# EAGLE schematic SummerCart64 (EAGLE 9.6.2)
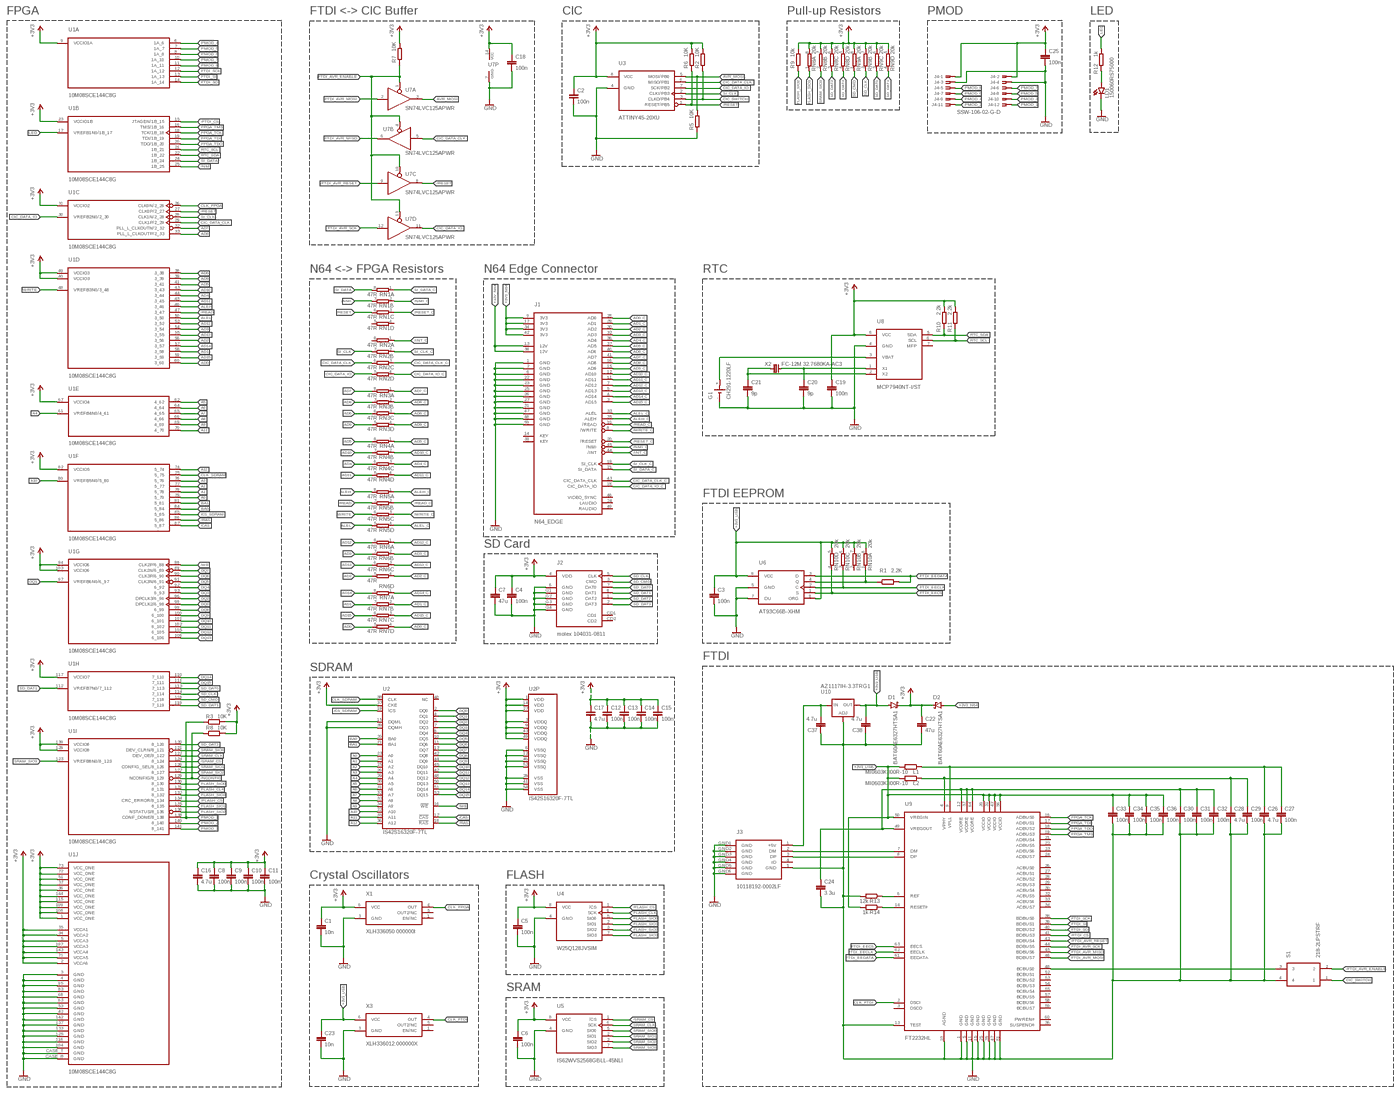
[diagram p0: schematic, sheet 1, overview]
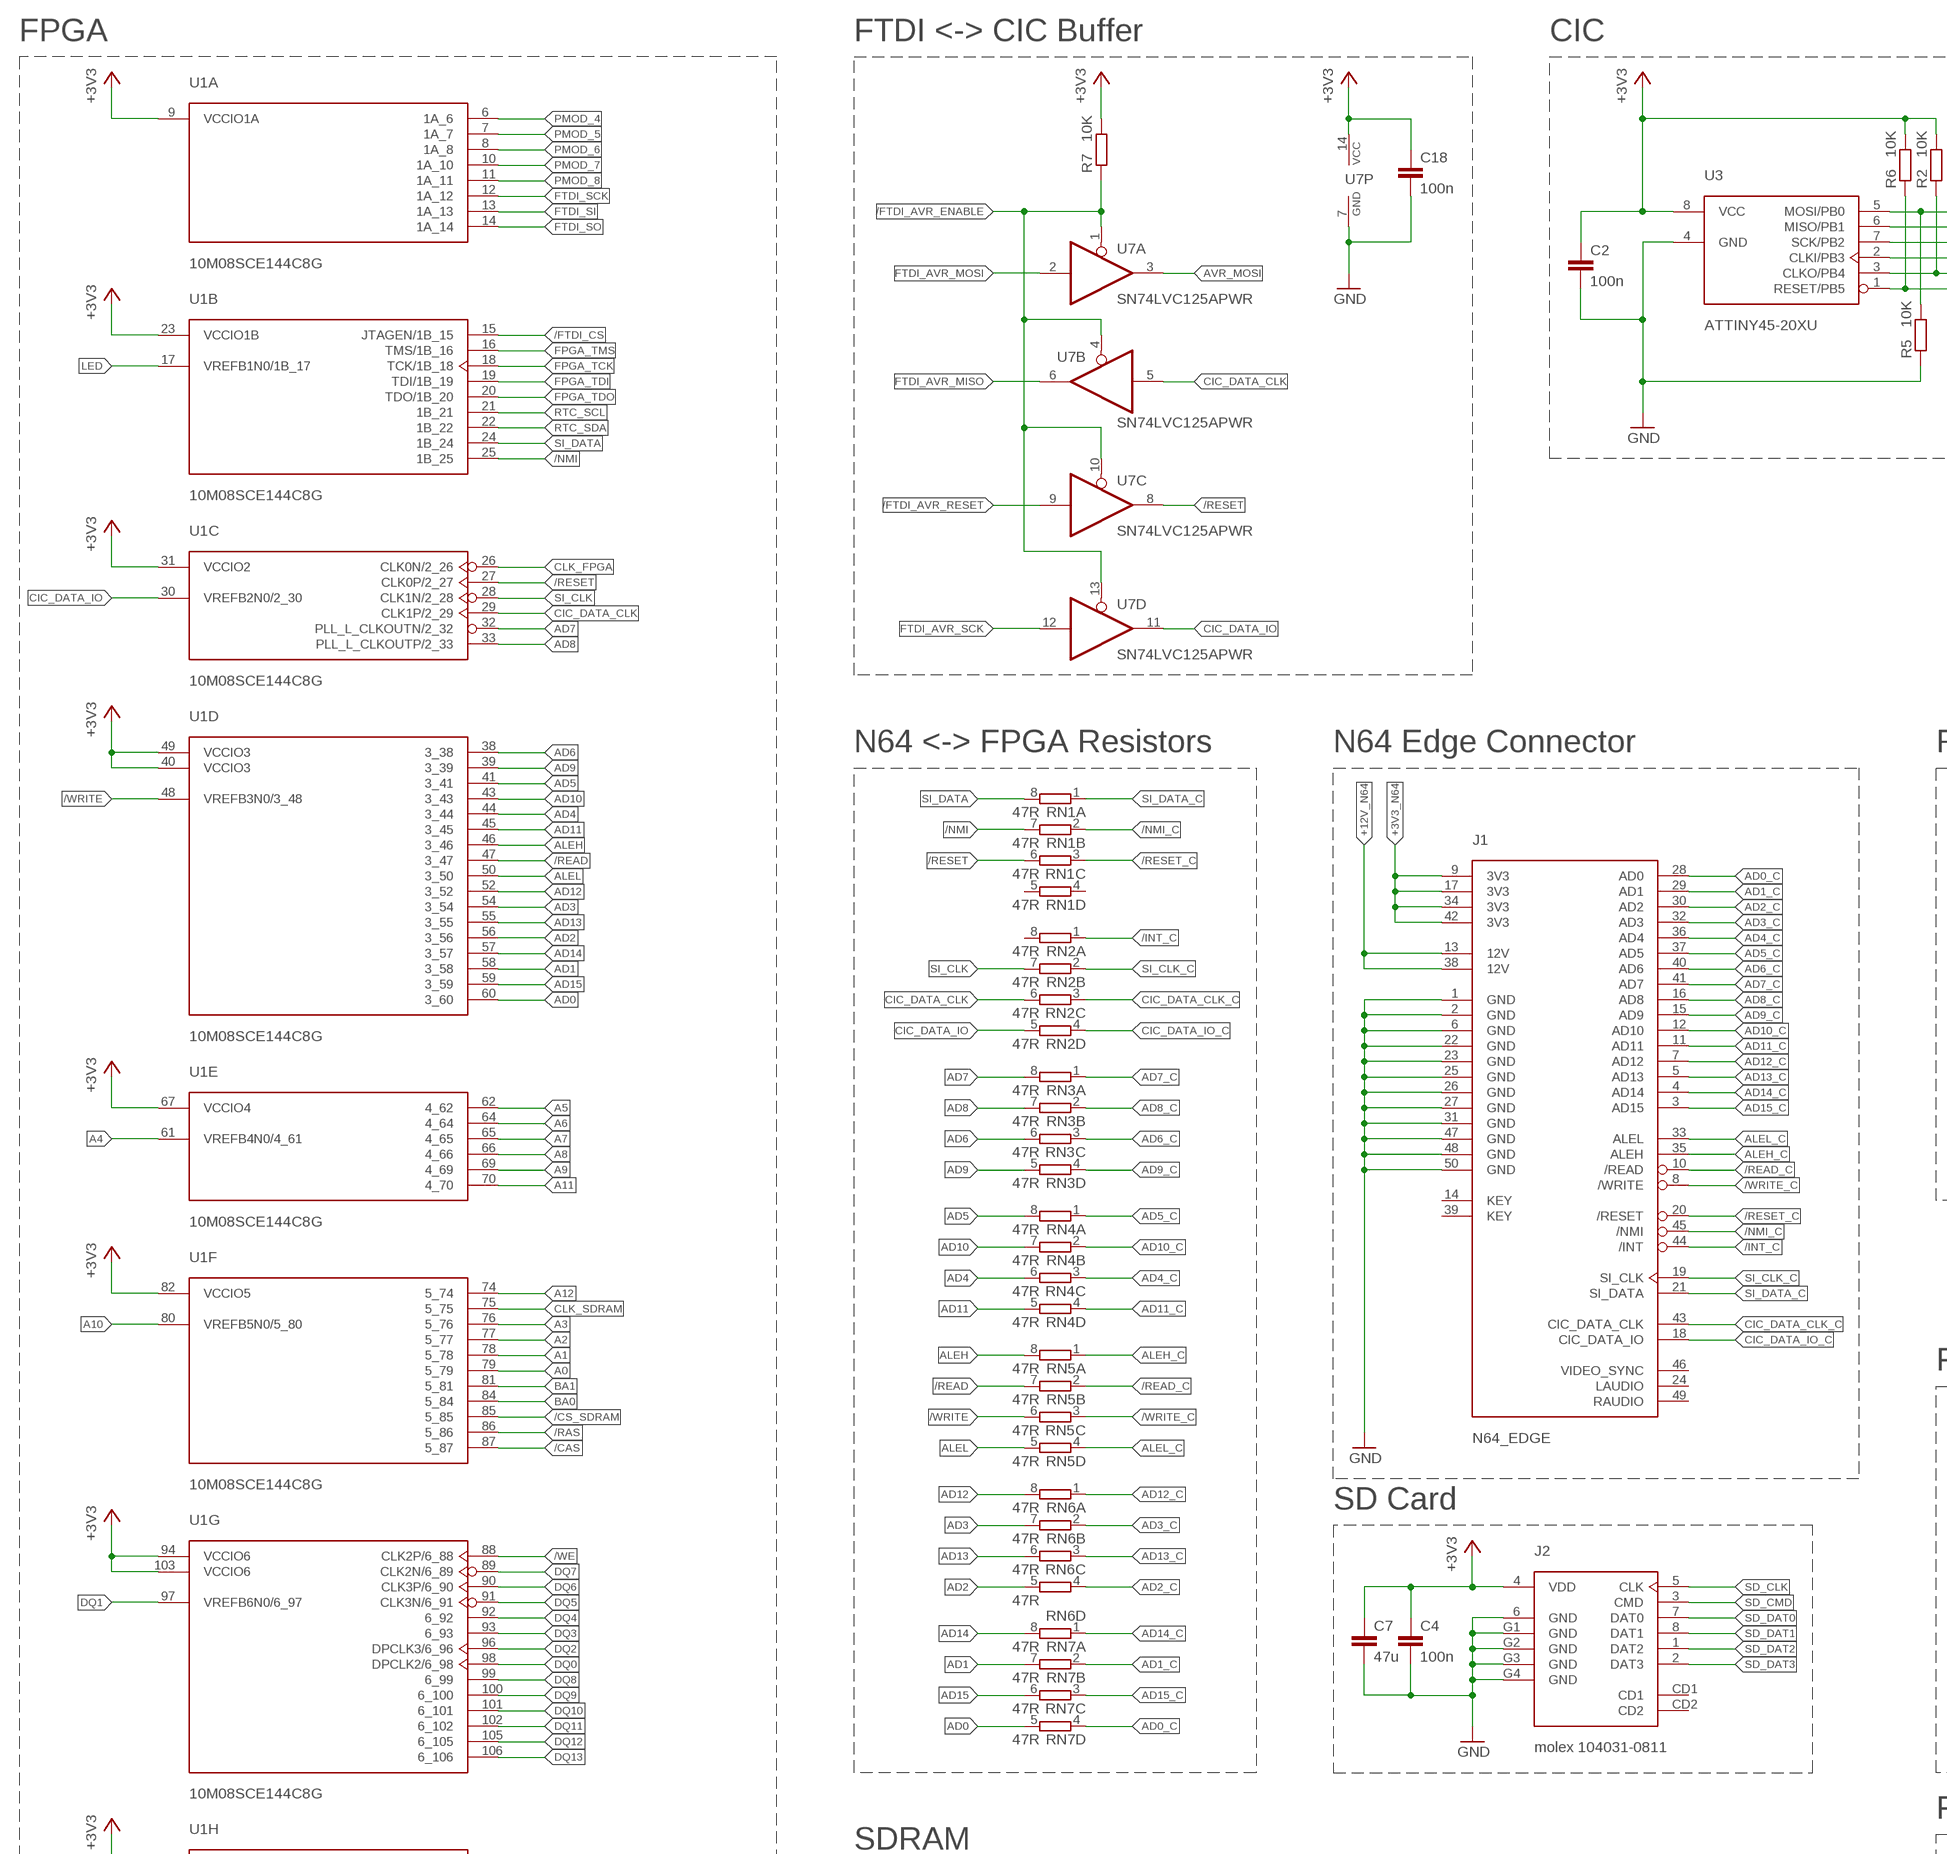
[diagram p1: schematic, sheet 1, part 1 of 4]
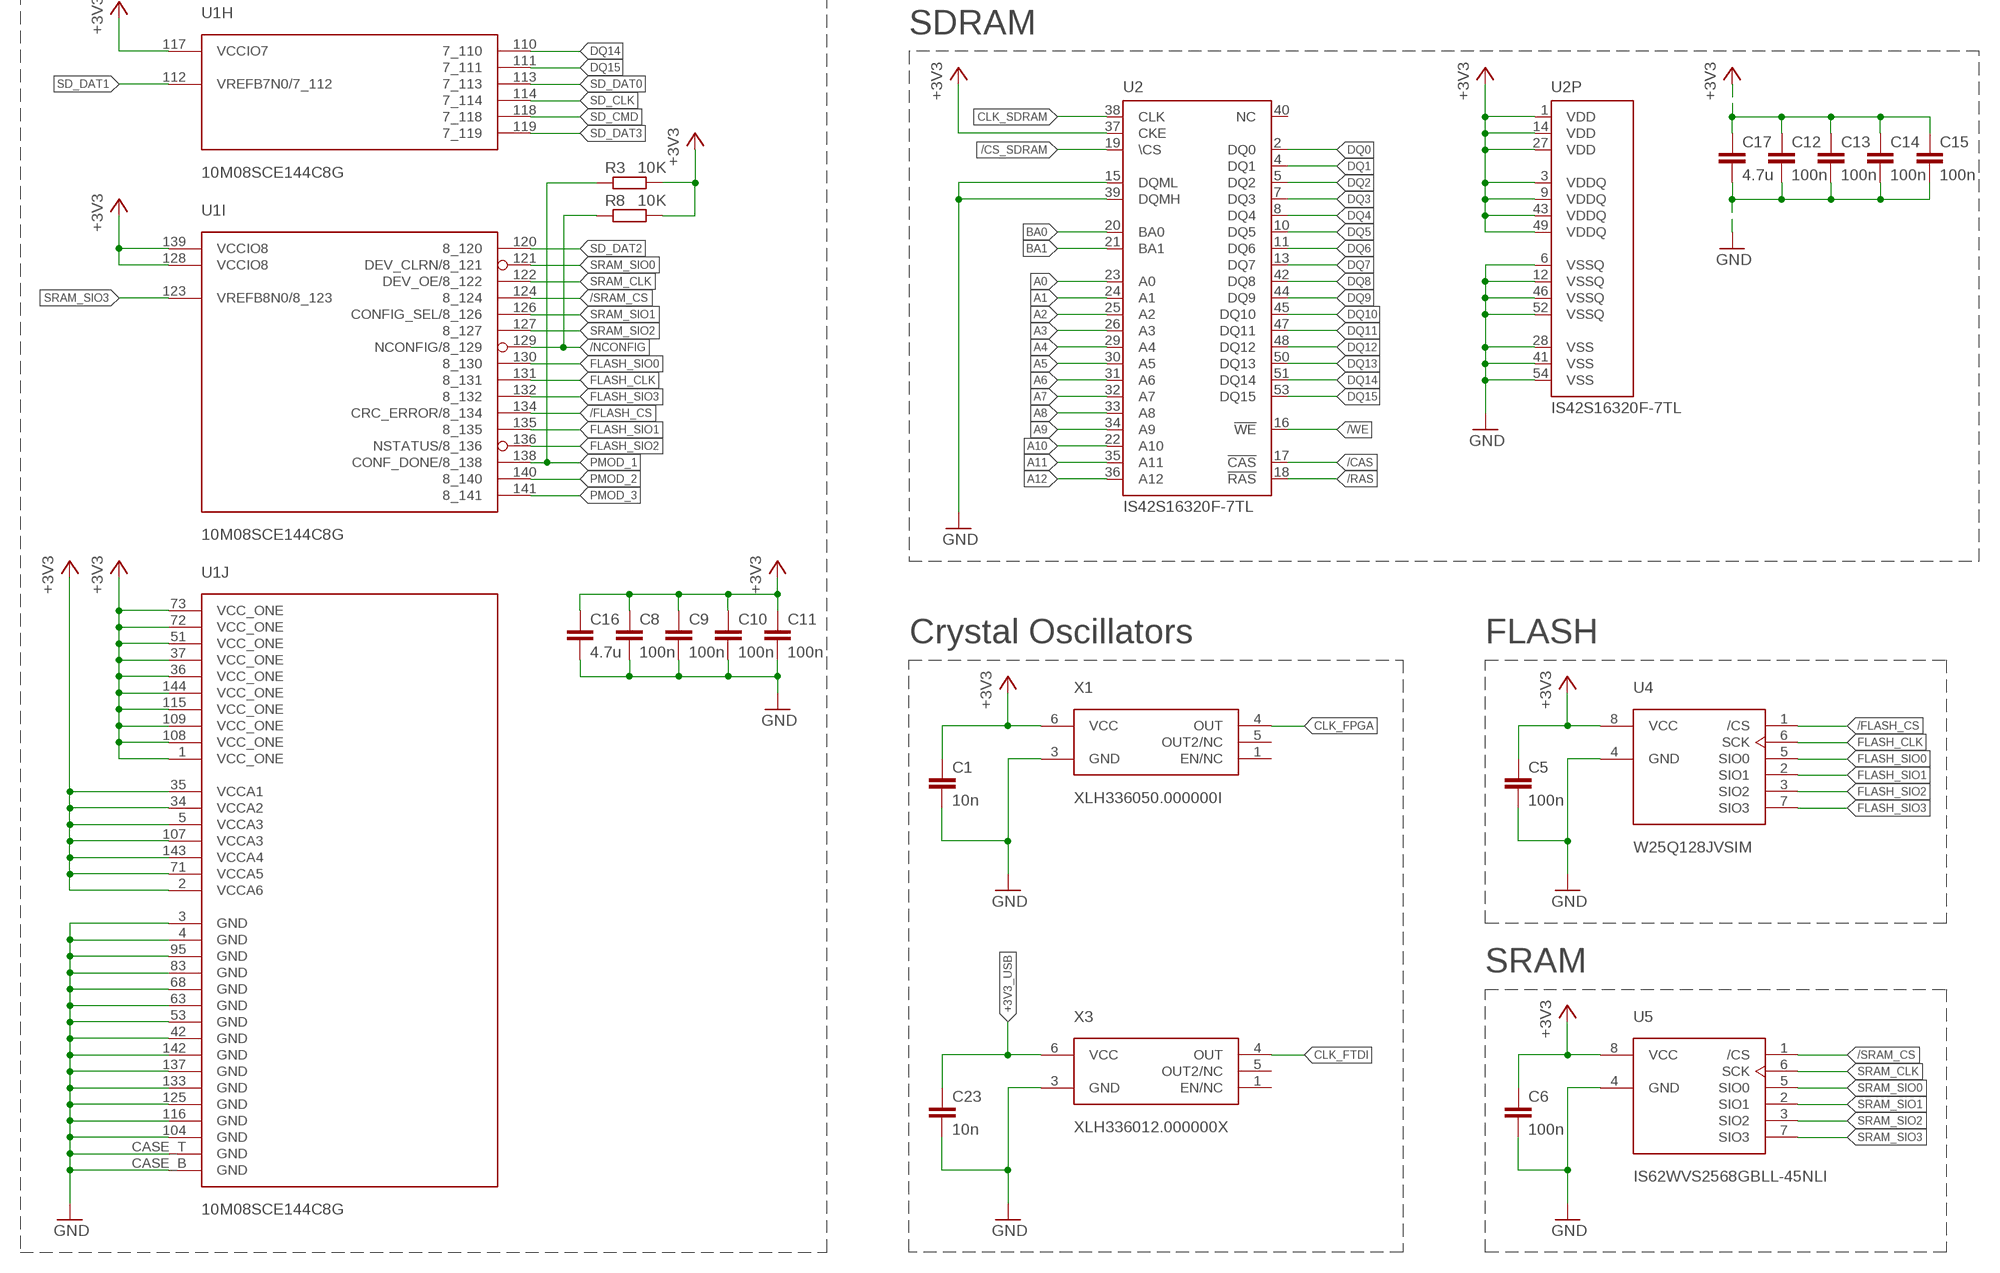
[diagram p2: schematic, sheet 1, part 2 of 4]
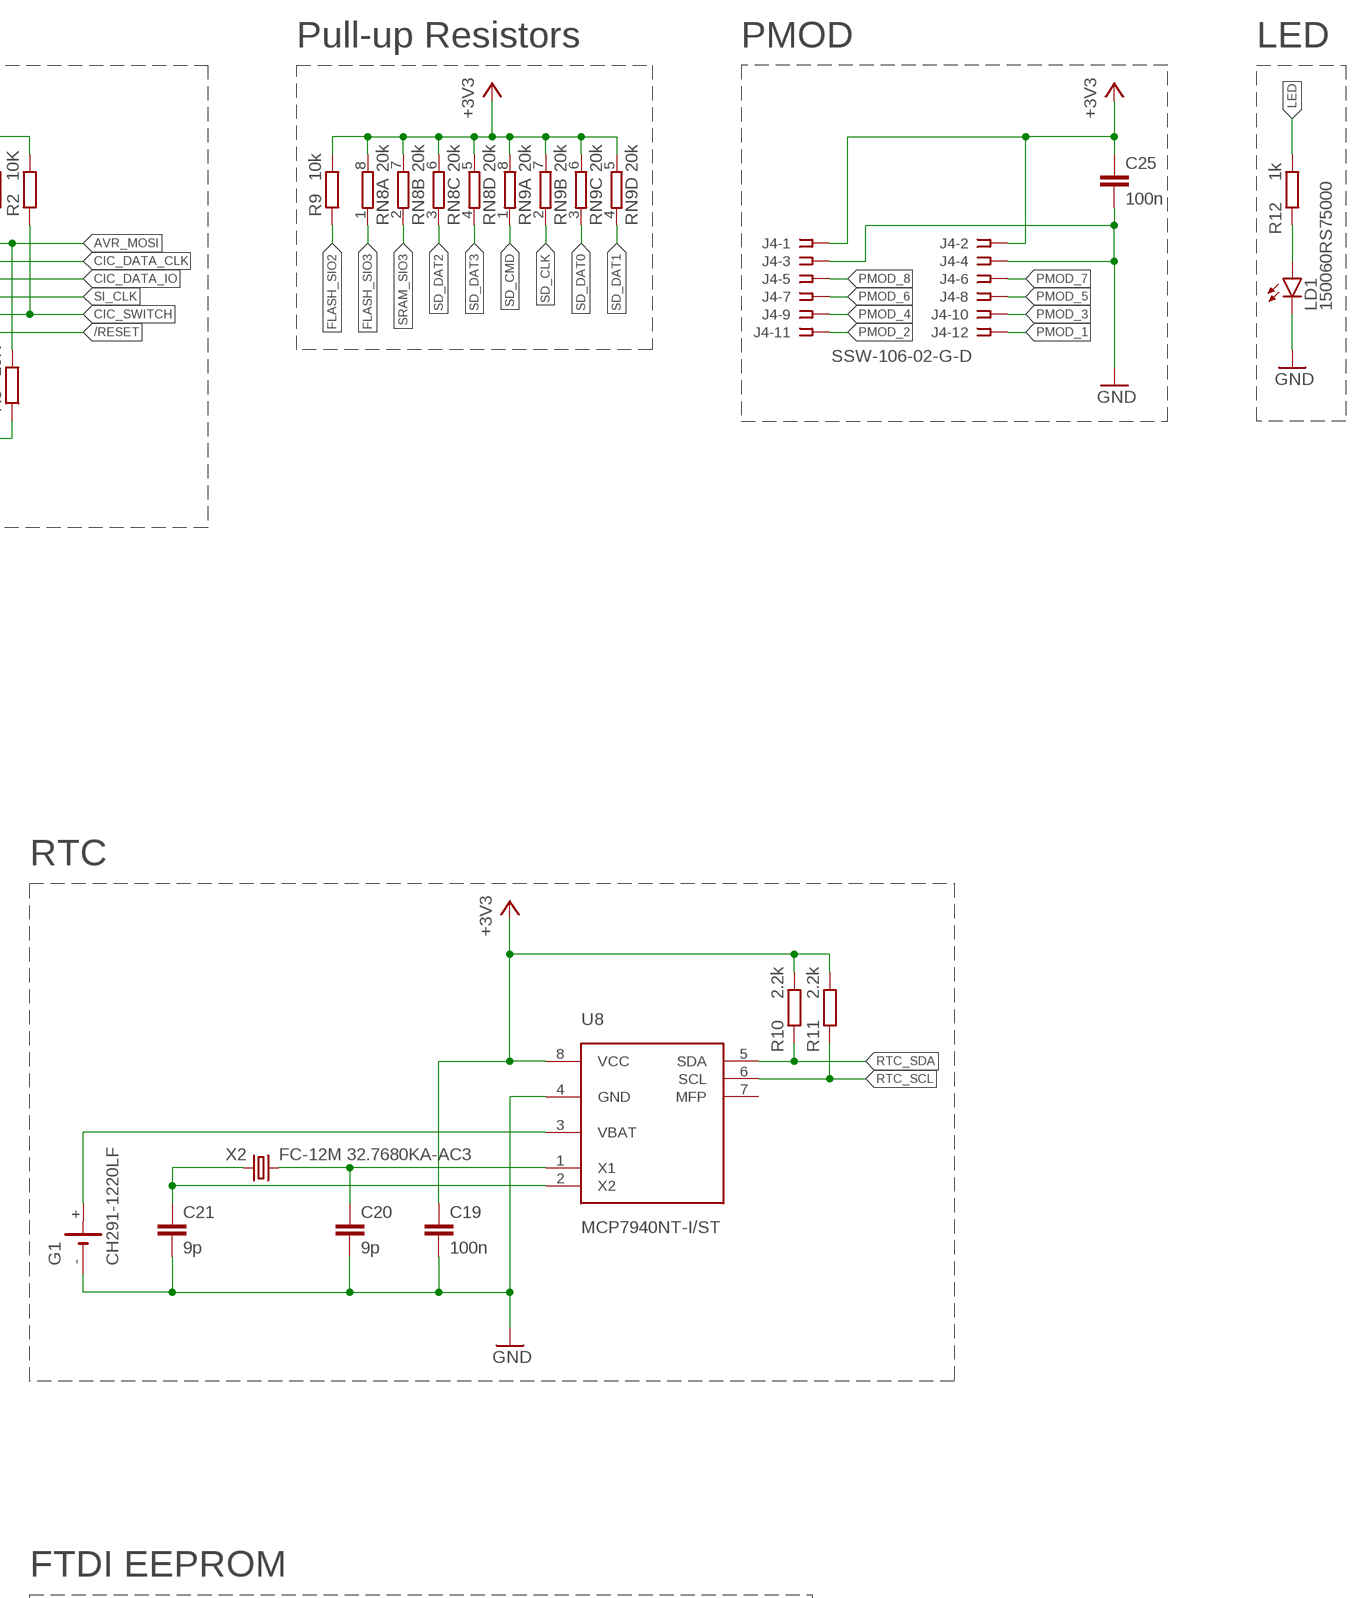
[diagram p3: schematic, sheet 1, part 3 of 4]
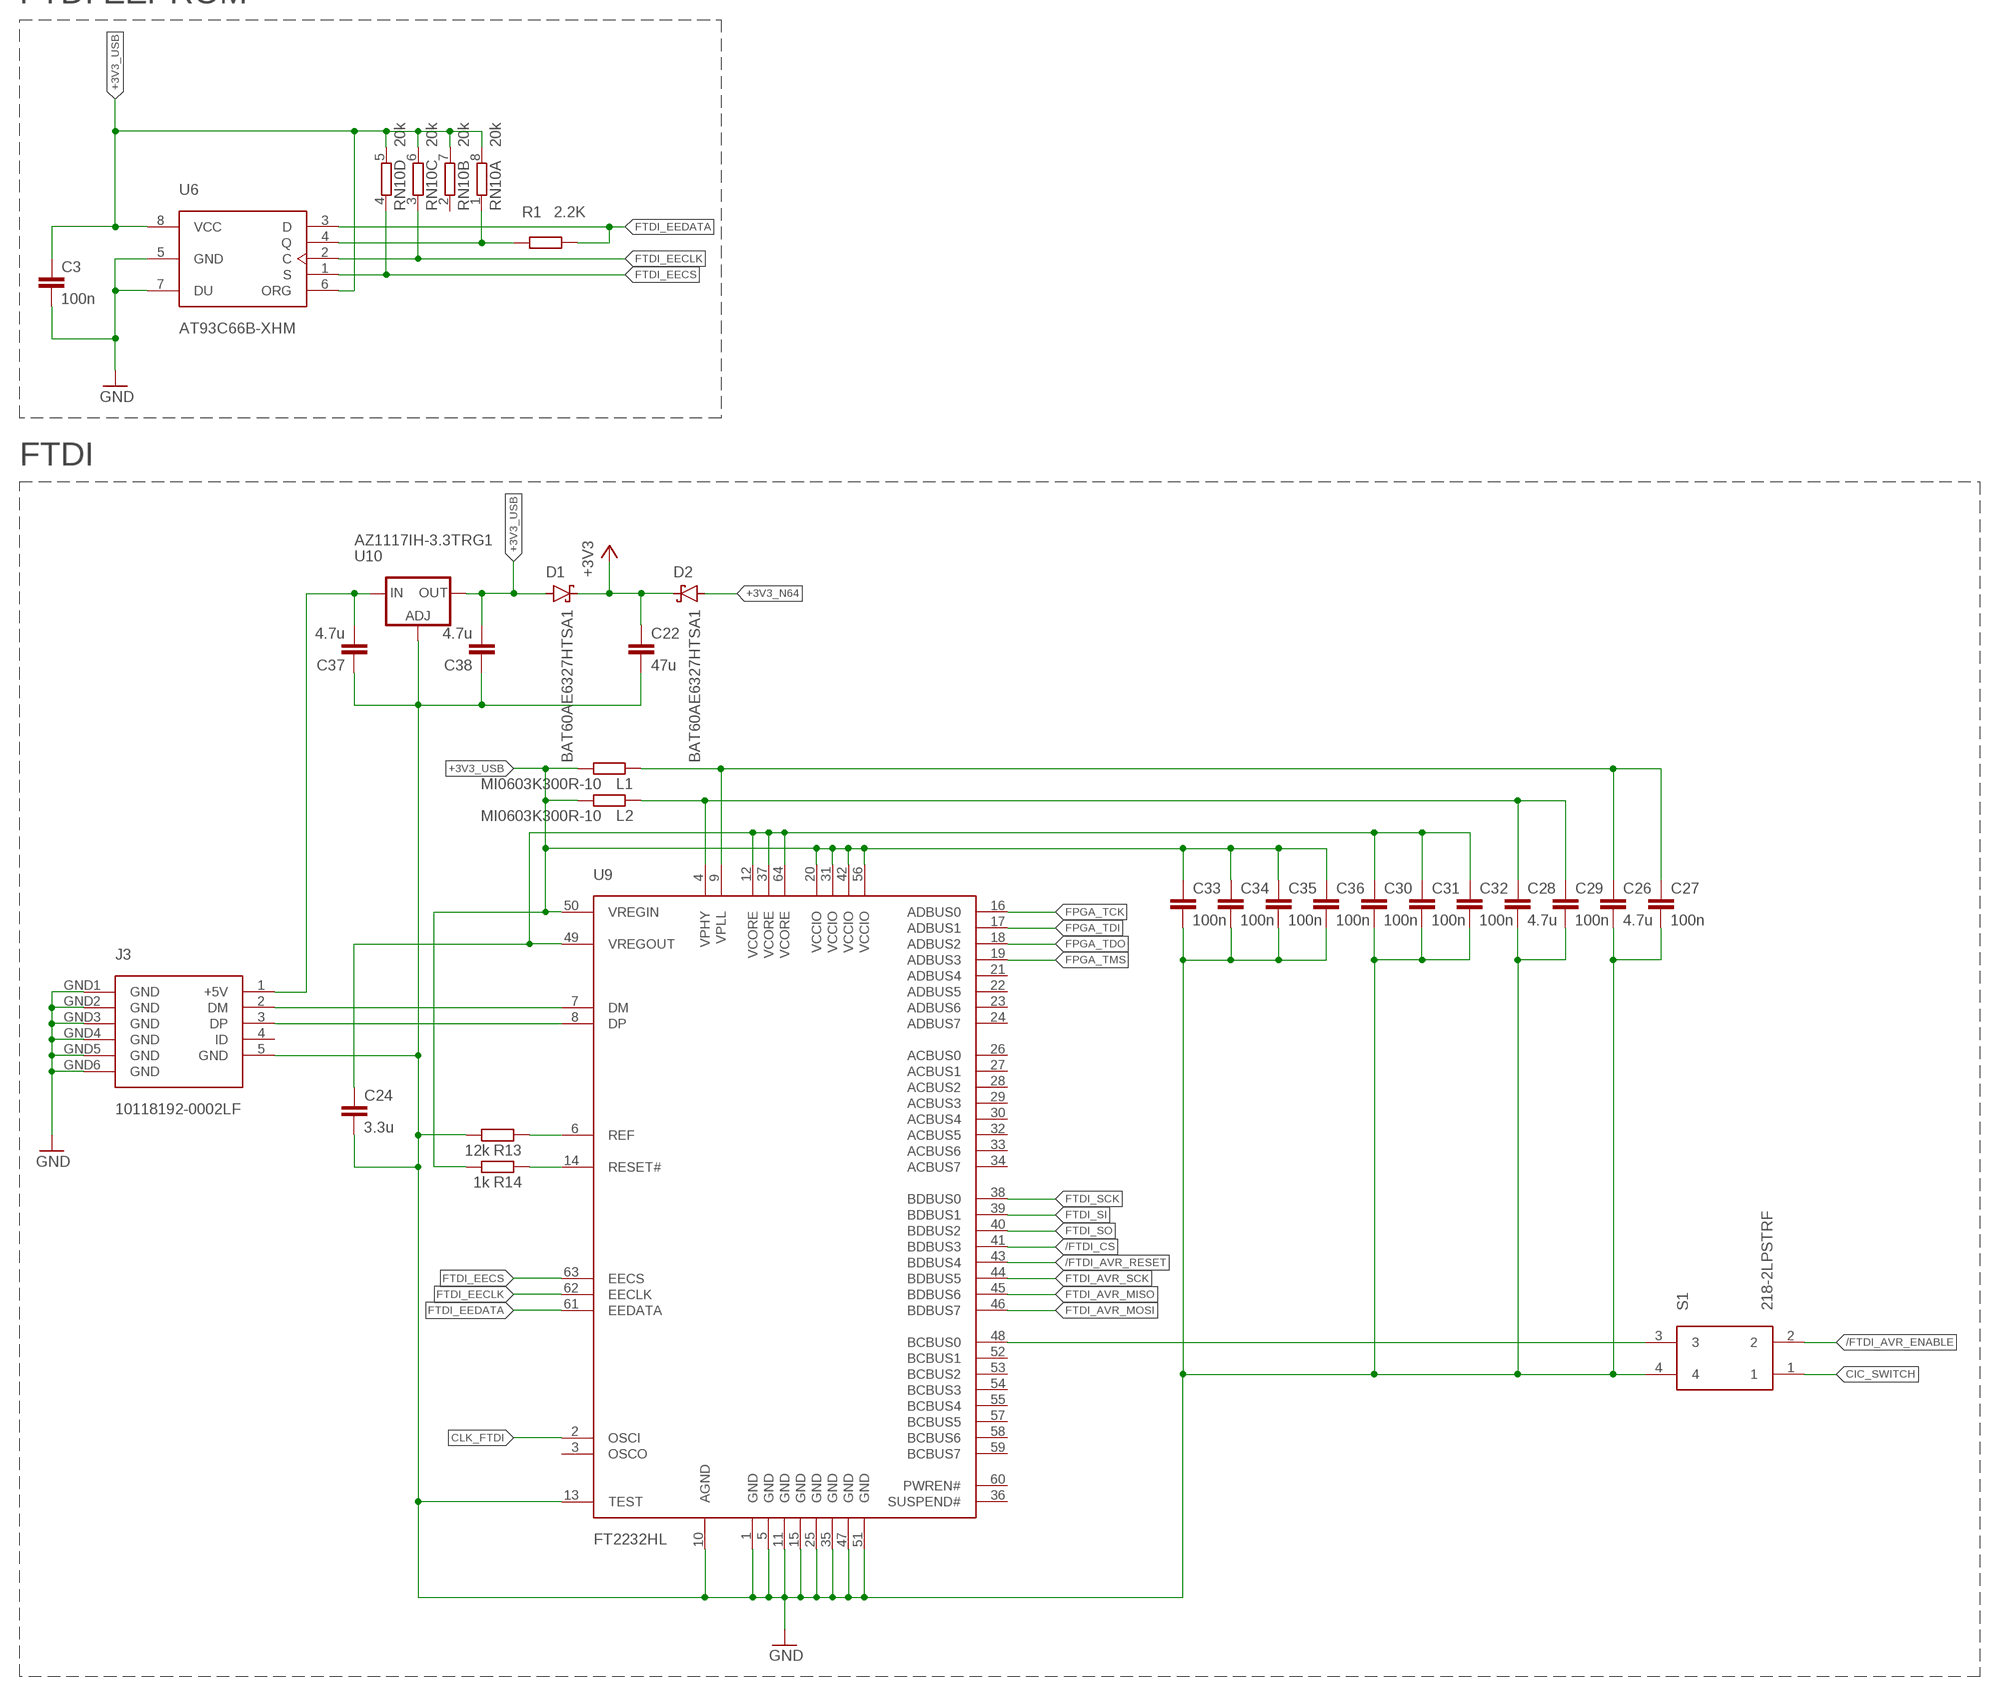
[diagram p4: schematic, sheet 1, part 4 of 4]

## Parts
C1  10n  C-EUC0603  [C0603]
C2  100n  C-EUC0603  [C0603]
C3  100n  C-EUC0603  [C0603]
C4  100n  C-EUC0603  [C0603]
C5  100n  C-EUC0603  [C0603]
C6  100n  C-EUC0603  [C0603]
C7  47u  C-EUC0805  [C0805]
C8  100n  C-EUC0603  [C0603]
C9  100n  C-EUC0603  [C0603]
C10  100n  C-EUC0603  [C0603]
C11  100n  C-EUC0603  [C0603]
C12  100n  C-EUC0603  [C0603]
C13  100n  C-EUC0603  [C0603]
C14  100n  C-EUC0603  [C0603]
C15  100n  C-EUC0603  [C0603]
C16  4.7u  C-EUC0603  [C0603]
C17  4.7u  C-EUC0603  [C0603]
C18  100n  C-EUC0603  [C0603]
C19  100n  C-EUC0603  [C0603]
C20  9p  C-EUC0603  [C0603]
C21  9p  C-EUC0603  [C0603]
C22  47u  C-EUC0805  [C0805]
C23  10n  C-EUC0603  [C0603]
C24  3.3u  C-EUC0603  [C0603]
C25  100n  C-EUC0603  [C0603]
C26  4.7u  C-EUC0603  [C0603]
C27  100n  C-EUC0603  [C0603]
C28  4.7u  C-EUC0603  [C0603]
C29  100n  C-EUC0603  [C0603]
C30  100n  C-EUC0603  [C0603]
C31  100n  C-EUC0603  [C0603]
C32  100n  C-EUC0603  [C0603]
C33  100n  C-EUC0603  [C0603]
C34  100n  C-EUC0603  [C0603]
C35  100n  C-EUC0603  [C0603]
C36  100n  C-EUC0603  [C0603]
C37  4.7u  C-EUC0603  [C0603]
C38  4.7u  C-EUC0603  [C0603]
D1  BAT60AE6327HTSA1  BAT60J  [SOD323_ST]
D2  BAT60AE6327HTSA1  BAT60J  [SOD323_ST]
G1  CH291-1220LF  [CH291-1220LF]
J1  N64_EDGE  [N64_EDGE]
J2  molex 104031-0811  MICRO_SD  [MICRO_SD]
J3  10118192-0002LF  MICRO_USB  [MICRO_USB]
J4  SSW-106-02-G-D  [SSW-106-02-G-D]
L1  MI0603K300R-10  R-EU_R0603  [R0603]
L2  MI0603K300R-10  R-EU_R0603  [R0603]
LD1  150060RS75000  LEDSML0603  [SML0603]
R1  2.2K  R-EU_R0603  [R0603]
R2  10K  R-EU_R0603  [R0603]
R3  10K  R-EU_R0603  [R0603]
R5  10K  R-EU_R0603  [R0603]
R6  10K  R-EU_R0603  [R0603]
R7  10K  R-EU_R0603  [R0603]
R8  10K  R-EU_R0603  [R0603]
R9  10k  R-EU_R0603  [R0603]
R10  2.2k  R-EU_R0603  [R0603]
R11  2.2k  R-EU_R0603  [R0603]
R12  1k  R-EU_R0603  [R0603]
R13  12k  R-EU_R0603  [R0603]
R14  1k  R-EU_R0603  [R0603]
RN1  47R  4R-NCAY16  [CAY16]
RN2  47R  4R-NCAY16  [CAY16]
RN3  47R  4R-NCAY16  [CAY16]
RN4  47R  4R-NCAY16  [CAY16]
RN5  47R  4R-NCAY16  [CAY16]
RN6  47R  4R-NCAY16  [CAY16]
RN7  47R  4R-NCAY16  [CAY16]
RN8  20k  4R-NCAY16  [CAY16]
RN9  20k  4R-NCAY16  [CAY16]
RN10  20k  4R-NCAY16  [CAY16]
S1  218-2LPSTRF  218-2  [218-2]
U1  10M08SCE144C8G  [EQFP144]
U2  IS42S16320F-7TL  MT48LC16M16A2  [TSOP54-400]
U3  ATTINY45-20XU  ATTINY45  [TSSOP8]
U4  W25Q128JVSIM  [SO8_208MIL]
U5  IS62WVS2568GBLL-45NLI  [SO8_150MIL]
U6  AT93C66B-XHM  93C66  [TSSOP8]
U7  SN74LVC125APWR  74ABT125PW  [TSSOP14]
U8  MCP7940NT-I/ST  MCP7940N  [TSSOP8]
U9  FT2232HL  [LQFP64]
U10  AZ1117IH-3.3TRG1  LD117AS33TR  [SOT223]
X1  XLH336050.000000I  XLH336  [3.2X2.5_OSCILLATOR]
X2  FC-12M 32.7680KA-AC3  FC-12M  [FC-12M]
X3  XLH336012.000000X  XLH336  [3.2X2.5_OSCILLATOR]

## Nets
+1.8V_USB: C24.1 C30.1 C31.1 C32.1 U9.12(VCORE) U9.37(VCORE) U9.49(VREGOUT) U9.64(VCORE)
+3V3: C1.1 C2.1 C4.1 C5.1 C6.1 C7.1 C8.1 C9.1 C10.1 C11.1 C12.1 C13.1 C14.1 C15.1 C16.1 C17.1 C18.1 C19.1 C22.1 C25.1 D1.C D2.C J2.4(VDD) J4.1 J4.2 R2.2 R3.2 R6.2 R7.2 R8.2 R9.2 R10.2 R11.2 RN8.5 RN8.6 RN8.7 RN8.8 RN9.5 RN9.6 RN9.7 RN9.8 U1.1(J:VCC_ONE) U1.2(J:VCCA6) U1.5(J:VCCA3) U1.9(A:VCCIO1A) U1.23(B:VCCIO1B) U1.31(C:VCCIO2) U1.34(J:VCCA2) U1.35(J:VCCA1) U1.36(J:VCC_ONE) U1.37(J:VCC_ONE) U1.40(D:VCCIO3) U1.49(D:VCCIO3) U1.51(J:VCC_ONE) U1.67(E:VCCIO4) U1.71(J:VCCA5) U1.72(J:VCC_ONE) U1.73(J:VCC_ONE) U1.82(F:VCCIO5) U1.94(G:VCCIO6) U1.103(G:VCCIO6) U1.107(J:VCCA3) U1.108(J:VCC_ONE) U1.109(J:VCC_ONE) U1.115(J:VCC_ONE) U1.117(H:VCCIO7) U1.128(I:VCCIO8) U1.139(I:VCCIO8) U1.143(J:VCCA4) U1.144(J:VCC_ONE) U2.1(VDD) U2.3(VDDQ) U2.9(VDDQ) U2.14(VDD) U2.27(VDD) U2.37(CKE) U2.43(VDDQ) U2.49(VDDQ) U3.8(VCC) U4.8(VCC) U5.8(VCC) U7.14(P:VCC) U8.8(VCC) X1.6(VCC)
+3V3_N64: D2.A J1.9(3V3) J1.17(3V3) J1.34(3V3) J1.42(3V3)
+3V3_USB: C3.1 C23.1 C33.1 C34.1 C35.1 C36.1 C38.2 D1.A L1.2 L2.2 R14.2 RN10.5 RN10.6 RN10.7 RN10.8 U6.6(ORG) U6.8(VCC) U9.20(VCCIO) U9.31(VCCIO) U9.42(VCCIO) U9.50(VREGIN) U9.56(VCCIO) U10.4(OUT) X3.6(VCC)
+5V_USB: C37.2 J3.1(+5V) U10.3(IN)
+12V_N64: J1.13(12V) J1.38(12V)
/CAS: U1.87(F:5_87) U2.17(!CAS)
/CS_SDRAM: U1.85(F:5_85) U2.19(\CS)
/FLASH_CS: U1.134(I:CRC_ERROR/8_134) U4.1(/CS)
/FTDI_AVR_ENABLE: R7.1 S1.2 U7.1(A:OE) U7.4(B:OE) U7.10(C:OE) U7.13(D:OE)
/FTDI_AVR_RESET: U7.9(C:I) U9.43(BDBUS4)
/FTDI_CS: U1.15(B:JTAGEN/1B_15) U9.41(BDBUS3)
/INT_C: J1.44(/INT) RN2.1
/NCONFIG: R8.1 U1.129(I:NCONFIG/8_129)
/NMI: RN1.7 U1.25(B:1B_25)
/NMI_C: J1.45(/NMI) RN1.2
/RAS: U1.86(F:5_86) U2.18(!RAS)
/READ: RN5.7 U1.47(D:3_47)
/READ_C: J1.10(/READ) RN5.2
/RESET: R6.1 RN1.6 U1.27(C:CLK0P/2_27) U3.1(RESET/PB5) U7.8(C:O)
/RESET_C: J1.20(/RESET) RN1.3
/SRAM_CS: U1.124(I:8_124) U5.1(/CS)
/WE: U1.88(G:CLK2P/6_88) U2.16(!WE)
/WRITE: RN5.6 U1.48(D:VREFB3N0/3_48)
/WRITE_C: J1.8(/WRITE) RN5.3
A0: U1.79(F:5_79) U2.23(A0)
A1: U1.78(F:5_78) U2.24(A1)
A2: U1.77(F:5_77) U2.25(A2)
A3: U1.76(F:5_76) U2.26(A3)
A4: U1.61(E:VREFB4N0/4_61) U2.29(A4)
A5: U1.62(E:4_62) U2.30(A5)
A6: U1.64(E:4_64) U2.31(A6)
A7: U1.65(E:4_65) U2.32(A7)
A8: U1.66(E:4_66) U2.33(A8)
A9: U1.69(E:4_69) U2.34(A9)
A10: U1.80(F:VREFB5N0/5_80) U2.22(A10)
A11: U1.70(E:4_70) U2.35(A11)
A12: U1.74(F:5_74) U2.36(A12)
AD0: RN7.5 U1.60(D:3_60)
AD0_C: J1.28(AD0) RN7.4
AD1: RN7.7 U1.58(D:3_58)
AD1_C: J1.29(AD1) RN7.2
AD2: RN6.5 U1.56(D:3_56)
AD2_C: J1.30(AD2) RN6.4
AD3: RN6.7 U1.54(D:3_54)
AD3_C: J1.32(AD3) RN6.2
AD4: RN4.6 U1.44(D:3_44)
AD4_C: J1.36(AD4) RN4.3
AD5: RN4.8 U1.41(D:3_41)
AD5_C: J1.37(AD5) RN4.1
AD6: RN3.6 U1.38(D:3_38)
AD6_C: J1.40(AD6) RN3.3
AD7: RN3.8 U1.32(C:PLL_L_CLKOUTN/2_32)
AD7_C: J1.41(AD7) RN3.1
AD8: RN3.7 U1.33(C:PLL_L_CLKOUTP/2_33)
AD8_C: J1.16(AD8) RN3.2
AD9: RN3.5 U1.39(D:3_39)
AD9_C: J1.15(AD9) RN3.4
AD10: RN4.7 U1.43(D:3_43)
AD10_C: J1.12(AD10) RN4.2
AD11: RN4.5 U1.45(D:3_45)
AD11_C: J1.11(AD11) RN4.4
AD12: RN6.8 U1.52(D:3_52)
AD12_C: J1.7(AD12) RN6.1
AD13: RN6.6 U1.55(D:3_55)
AD13_C: J1.5(AD13) RN6.3
AD14: RN7.8 U1.57(D:3_57)
AD14_C: J1.4(AD14) RN7.1
AD15: RN7.6 U1.59(D:3_59)
AD15_C: J1.3(AD15) RN7.3
ALEH: RN5.8 U1.46(D:3_46)
ALEH_C: J1.35(ALEH) RN5.1
ALEL: RN5.5 U1.50(D:3_50)
ALEL_C: J1.33(ALEL) RN5.4
AVR_MOSI: R5.2 U3.5(MOSI/PB0) U7.3(A:O)
BA0: U1.84(F:5_84) U2.20(BA0)
BA1: U1.81(F:5_81) U2.21(BA1)
CIC_DATA_CLK: RN2.6 U1.29(C:CLK1P/2_29) U3.6(MISO/PB1) U7.5(B:I)
CIC_DATA_CLK_C: J1.43(CIC_DATA_CLK) RN2.3
CIC_DATA_IO: RN2.5 U1.30(C:VREFB2N0/2_30) U3.7(SCK/PB2) U7.11(D:O)
CIC_DATA_IO_C: J1.18(CIC_DATA_IO) RN2.4
CIC_SWITCH: R2.1 S1.1 U3.3(CLKO/PB4)
CLK_FPGA: U1.26(C:CLK0N/2_26) X1.4(OUT)
CLK_FTDI: U9.2(OSCI) X3.4(OUT)
CLK_SDRAM: U1.75(F:5_75) U2.38(CLK)
D_N: J3.2(DM) U9.7(DM)
D_P: J3.3(DP) U9.8(DP)
DQ0: U1.98(G:DPCLK2/6_98) U2.2(DQ0)
DQ1: U1.97(G:VREFB6N0/6_97) U2.4(DQ1)
DQ2: U1.96(G:DPCLK3/6_96) U2.5(DQ2)
DQ3: U1.93(G:6_93) U2.7(DQ3)
DQ4: U1.92(G:6_92) U2.8(DQ4)
DQ5: U1.91(G:CLK3N/6_91) U2.10(DQ5)
DQ6: U1.90(G:CLK3P/6_90) U2.11(DQ6)
DQ7: U1.89(G:CLK2N/6_89) U2.13(DQ7)
DQ8: U1.99(G:6_99) U2.42(DQ8)
DQ9: U1.100(G:6_100) U2.44(DQ9)
DQ10: U1.101(G:6_101) U2.45(DQ10)
DQ11: U1.102(G:6_102) U2.47(DQ11)
DQ12: U1.105(G:6_105) U2.48(DQ12)
DQ13: U1.106(G:6_106) U2.50(DQ13)
DQ14: U1.110(H:7_110) U2.51(DQ14)
DQ15: U1.111(H:7_111) U2.53(DQ15)
FLASH_CLK: U1.131(I:8_131) U4.6(SCK)
FLASH_SIO0: U1.130(I:8_130) U4.5(SIO0)
FLASH_SIO1: U1.135(I:8_135) U4.2(SIO1)
FLASH_SIO2: R9.1 U1.136(I:NSTATUS/8_136) U4.3(SIO2)
FLASH_SIO3: RN8.1 U1.132(I:8_132) U4.7(SIO3)
FPGA_TCK: U1.18(B:TCK/1B_18) U9.16(ADBUS0)
FPGA_TDI: U1.19(B:TDI/1B_19) U9.17(ADBUS1)
FPGA_TDO: U1.20(B:TDO/1B_20) U9.18(ADBUS2)
FPGA_TMS: U1.16(B:TMS/1B_16) U9.19(ADBUS3)
FTDI_AVR_MISO: U7.6(B:O) U9.45(BDBUS6)
FTDI_AVR_MOSI: U7.2(A:I) U9.46(BDBUS7)
FTDI_AVR_SCK: U7.12(D:I) U9.44(BDBUS5)
FTDI_EECLK: RN10.3 U6.2(C) U9.62(EECLK)
FTDI_EECS: RN10.4 U6.1(S) U9.63(EECS)
FTDI_EEDATA: R1.2 U6.3(D) U9.61(EEDATA)
FTDI_REF: R13.1 U9.6(REF)
FTDI_RESET: R14.1 U9.14(RESET#)
FTDI_SCK: U1.12(A:1A_12) U9.38(BDBUS0)
FTDI_SI: U1.13(A:1A_13) U9.39(BDBUS1)
FTDI_SO: U1.14(A:1A_14) U9.40(BDBUS2)
FTDI_VPHY: C28.1 C29.1 L2.1 U9.4(VPHY)
FTDI_VPLL: C26.1 C27.1 L1.1 U9.9(VPLL)
GND: C1.2 C2.2 C3.2 C4.2 C5.2 C6.2 C7.2 C8.2 C9.2 C10.2 C11.2 C12.2 C13.2 C14.2 C15.2 C16.2 C17.2 C18.2 C19.2 C20.2 C21.2 C22.2 C23.2 C24.2 C25.2 C26.2 C27.2 C28.2 C29.2 C30.2 C31.2 C32.2 C33.2 C34.2 C35.2 C36.2 C37.1 C38.1 G1.- J1.1(GND) J1.2(GND) J1.6(GND) J1.22(GND) J1.23(GND) J1.25(GND) J1.26(GND) J1.27(GND) J1.31(GND) J1.47(GND) J1.48(GND) J1.50(GND) J2.6(GND) J2.G1(GND) J2.G2(GND) J2.G3(GND) J2.G4(GND) J3.5(GND) J3.GND1(GND) J3.GND2(GND) J3.GND3(GND) J3.GND4(GND) J3.GND5(GND) J3.GND6(GND) J4.3 J4.4 LD1.C R5.1 R13.2 S1.4 U1.3(J:GND) U1.4(J:GND) U1.42(J:GND) U1.53(J:GND) U1.63(J:GND) U1.68(J:GND) U1.83(J:GND) U1.95(J:GND) U1.104(J:GND) U1.116(J:GND) U1.125(J:GND) U1.133(J:GND) U1.137(J:GND) U1.142(J:GND) U1.CASE_B(J:GND) U1.CASE_T(J:GND) U2.6(VSSQ) U2.12(VSSQ) U2.15(DQML) U2.28(VSS) U2.39(DQMH) U2.41(VSS) U2.46(VSSQ) U2.52(VSSQ) U2.54(VSS) U3.4(GND) U4.4(GND) U5.4(GND) U6.5(GND) U6.7(DU) U7.7(P:GND) U8.4(GND) U9.1(GND) U9.5(GND) U9.10(AGND) U9.11(GND) U9.13(TEST) U9.15(GND) U9.25(GND) U9.35(GND) U9.47(GND) U9.51(GND) U10.1(ADJ) X1.3(GND) X3.3(GND)
LED: R12.2 U1.17(B:VREFB1N0/1B_17)
N$2: S1.3 U9.48(BCBUS0)
N$4: LD1.A R12.1
N$16: R1.1 RN10.1 U6.4(Q)
PMOD_1: J4.12 R3.1 U1.138(I:CONF_DONE/8_138)
PMOD_2: J4.11 U1.140(I:8_140)
PMOD_3: J4.10 U1.141(I:8_141)
PMOD_4: J4.9 U1.6(A:1A_6)
PMOD_5: J4.8 U1.7(A:1A_7)
PMOD_6: J4.7 U1.8(A:1A_8)
PMOD_7: J4.6 U1.10(A:1A_10)
PMOD_8: J4.5 U1.11(A:1A_11)
RTC_SCL: R11.1 U1.21(B:1B_21) U8.6(SCL)
RTC_SDA: R10.1 U1.22(B:1B_22) U8.5(SDA)
RTC_VBAT: G1.+ U8.3(VBAT)
RTC_X1: C20.1 U8.1(X1) X2.2
RTC_X2: C21.1 U8.2(X2) X2.1
SD_CLK: J2.5(CLK) RN9.2 U1.114(H:7_114)
SD_CMD: J2.3(CMD) RN9.1 U1.118(H:7_118)
SD_DAT0: J2.7(DAT0) RN9.3 U1.113(H:7_113)
SD_DAT1: J2.8(DAT1) RN9.4 U1.112(H:VREFB7N0/7_112)
SD_DAT2: J2.1(DAT2) RN8.3 U1.120(I:8_120)
SD_DAT3: J2.2(DAT3) RN8.4 U1.119(H:7_119)
SI_CLK: RN2.7 U1.28(C:CLK1N/2_28) U3.2(CLKI/PB3)
SI_CLK_C: J1.19(SI_CLK) RN2.2
SI_DATA: RN1.8 U1.24(B:1B_24)
SI_DATA_C: J1.21(SI_DATA) RN1.1
SRAM_CLK: U1.122(I:DEV_OE/8_122) U5.6(SCK)
SRAM_SIO0: U1.121(I:DEV_CLRN/8_121) U5.5(SIO0)
SRAM_SIO1: U1.126(I:CONFIG_SEL/8_126) U5.2(SIO1)
SRAM_SIO2: U1.127(I:8_127) U5.3(SIO2)
SRAM_SIO3: RN8.2 U1.123(I:VREFB8N0/8_123) U5.7(SIO3)
Unconnected: J1.14(KEY) J1.24(LAUDIO) J1.39(KEY) J1.46(VIDEO_SYNC) J1.49(RAUDIO) J2.CD1 J2.CD2 J3.4(ID) RN1.4 RN1.5 RN2.8 RN10.2 U2.40(NC) U8.7(MFP) U9.3(OSCO) U9.21(ADBUS4) U9.22(ADBUS5) U9.23(ADBUS6) U9.24(ADBUS7) U9.26(ACBUS0) U9.27(ACBUS1) U9.28(ACBUS2) U9.29(ACBUS3) U9.30(ACBUS4) U9.32(ACBUS5) U9.33(ACBUS6) U9.34(ACBUS7) U9.36(SUSPEND#) U9.52(BCBUS1) U9.53(BCBUS2) U9.54(BCBUS3) U9.55(BCBUS4) U9.57(BCBUS5) U9.58(BCBUS6) U9.59(BCBUS7) U9.60(PWREN#) X1.1(EN/NC) X1.5(OUT2/NC) X3.1(EN/NC) X3.5(OUT2/NC)

## Notes on the sheet
- FPGA | FTDI <-> CIC Buffer | CIC | Pull-up Resistors | PMOD | LED
- N64 <-> FPGA Resistors | N64 Edge Connector | RTC
- FTDI EEPROM
- SD Card
- FTDI
- SDRAM
- Crystal Oscillators | FLASH
- SRAM

## Library data of the parts
C1-C38 = rcl:C-EU: CAPACITOR, European symbol; SPICEPREFIX: C
D1 D2 = diode:BAT60J: Schottky barrier diode Source: www.st.com, BAT60J.pdf
G1 = battery:CH291-1220LF: Battery Holder, SMT, 12mm multicomp PART NO. CH291-1220LF Source: Data sheet <http://www.farnell.com/datasheets/1505860.pdf>
J1 = SummerCart64:N64_EDGE: Nintendo 64 cartridge edge connector.
J2 = SummerCart64:MICRO_SD
J3 = SummerCart64:MICRO_USB
J4 = con-samtec:SSW-106-02-G: THROUGH-HOLE .025" SQ POST SOCKET Source: Samtec SSW.pdf; MF: Samtec Inc.; MPN: SSW-106-02-G-D; OC_FARNELL: unknown; OC_NEWARK: 11P9414
L1 L2 R1-R3 R5-R14 = rcl:R-EU_: RESISTOR, European symbol; SPICEPREFIX: R
LD1 = led:LED: LED OSRAM: - CHIPLED LG R971, LG N971, LY N971, LG Q971, LY Q971, LO R971, LY R971 LH N974, LH R974 LS Q976, LO Q976, LY Q976 LO Q996 - Hyper CHIPLED LW Q18S LB Q993, LB Q99A, LB R99A - SideLED LS A670, LO A670, LY A670, LG A670, LP A670 LB A673, LV A673, LT A673, LW A673 LH A674 LY A675 LS A676, LA A676, LO A676, LY A676, LW A676 LS A679, LY A679, LG A679 - Hyper Micro SIDELED® LS Y876, LA Y876, LO Y876, LY Y876 LT Y87S - SmartLED LW L88C, LW L88S LB L89C, LB L89S, LG L890 LS L89K, LO L89K, LY L89K LS L896, LA L896, LO L896, LY L896 - TOPLED LS T670, LO T670, LY T670, LG T670, LP T670 LSG T670, LSP T670, LSY T670, LOP T670, LYG T670 LG T671, LOG T671, LSG T671 LB T673, LV T673, LT T673, LW T673 LH T674 LS T676, LA T676, LO T676, LY T676, LB T676, LH T676, LSB T676, LW T676 LB T67C, LV T67C, LT T67C, LS T67K, LO T67K, LY T67K, LW E67C LS E67B, LA E67B, LO E67B, LY E67B, LB E67C, LV E67C, LT E67C LW T67C LS T679, LY T679, LG T679 LS T770, LO T770, LY T770, LG T770, LP T770 LB T773, LV T773, LT T773, LW T773 LH T774 LS E675, LA E675, LY E675, LS T675 LS T776, LA T776, LO T776, LY T776, LB T776 LHGB T686 LT T68C, LB T68C - Hyper Mini TOPLED® LB M676 - Mini TOPLED Santana® LG M470 LS M47K, LO M47K, LY M47K Source: http://www.osram.convergy.de LUXEON: - LUMILED® LXK2-PW12-R00, LXK2-PW12-S00, LXK2-PW14-U00, LXK2-PW14-V00 LXK2-PM12-R00, LXK2-PM12-S00, LXK2-PM14-U00 LXK2-PE12-Q00, LXK2-PE12-R00, LXK2-PE12-S00, LXK2-PE14-T00, LXK2-PE14-U00 LXK2-PB12-K00, LXK2-PB12-L00, LXK2-PB12-M00, LXK2-PB14-N00, LXK2-PB14-P00, LXK2-PB14-Q00 LXK2-PR12-L00, LXK2-PR12-M00, LXK2-PR14-Q00, LXK2-PR14-R00 LXK2-PD12-Q00, LXK2-PD12-R00, LXK2-PD12-S00 LXK2-PH12-R00, LXK2-PH12-S00 LXK2-PL12-P00, LXK2-PL12-Q00, LXK2-PL12-R00 Source: www.luxeon.com KINGBRIGHT: KA-3528ASYC Source: www.kingbright.com
RN1-RN10 = resistor-dil:4R-N: Array Chip Resistor Source: RS Component / Phycomp; OC_FARNELL: unknown; OC_NEWARK: unknown
S1 = SummerCart64:218-2
U1 = SummerCart64:10M08SCE144C8G
U2 = memory-micron:MT48LC16M16A2: 256Mb: x16 SDRAM MT48LC16M16A2 - 4 Meg x 16 x 4 banks Source: http://download.micron.com/pdf/datasheets/dram/sdram/256MSDRAM.pdf; OC_FARNELL: unknown; OC_NEWARK: unknown
U3 = SummerCart64:ATTINY45
U4 = SummerCart64:W25Q128JVSIM
U5 = SummerCart64:IS62WVS2568GBLL-45NLI
U6 = SummerCart64:93C66
U7 = 74xx-eu:74*125: Quad bus BUFFER, 3-state
U8 = SummerCart64:MCP7940N
U9 = SummerCart64:FT2232HL
U10 = v-reg:LD117A?*: Low drop fixed and adjustable positive voltage regulators 1 A Source: http://www.st.com/stonline/products/literature/ds/7194/ld1117axx.pdf
X1 X3 = SummerCart64:XLH336
X2 = crystal:FC-12M: kHz RANGE CRYSTAL UNIT LOW PROFILE SMD Source: Epson Toyocom FC-12M.pdf